# EAGLE design buzzer (EAGLE 5.11)
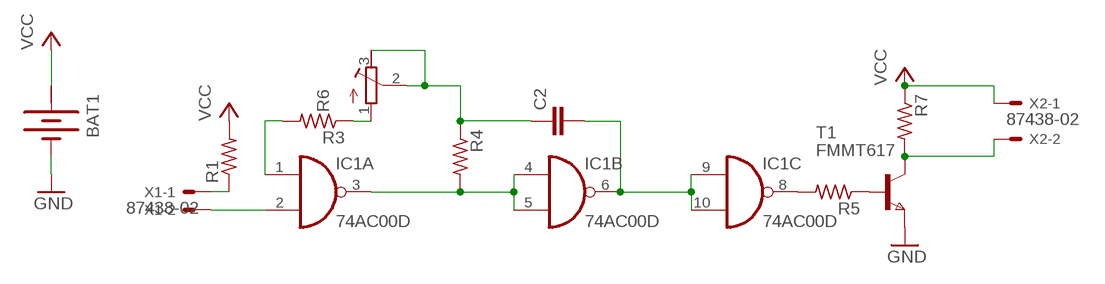
[diagram p0: schematic, sheet 1]

## Parts
BAT1  BATTERY  [BATTERY]
C2  C-EUC3225  [C3225]
IC1  74AC00D  [SO14]
R1  R-US_M0805  [M0805]
R3  R-US_M0805  [M0805]
R4  R-US_M0805  [M0805]
R5  R-US_M0805  [M0805]
R6  R-TRIMMTSM53YJ  [RTRIMTSM53YJ]
R7  R-US_M0805  [M0805]
T1  FMMT617  [SOT-23]
X1  87438-02  [87438-02]
X2  87438-02  [87438-02]

## Nets
GND: BAT1.- T1.2(E)
N$1: R5.1 T1.3(B)
N$2: IC1.1(A:I0) R3.2
N$3: IC1.3(A:O) IC1.4(B:I0) IC1.5(B:I1) R4.2
N$4: R3.1 R6.1(E)
N$5: C2.2 IC1.6(B:O) IC1.9(C:I0) IC1.10(C:I1)
N$6: R7.2 T1.1(C) X2.2
N$7: R1.1 X1.1
N$8: C2.1 R4.1 R6.2(S) R6.3(A)
N$9: IC1.2(A:I1) X1.2
N$10: IC1.8(C:O) R5.2
VCC: BAT1.+ R1.2 R7.1 X2.1
Unconnected: IC1.11(D:O) IC1.12(D:I0) IC1.13(D:I1)

## Power pins joined to a net without a drawn wire
+: BAT1.+@1(+)
GND: IC1.7(P:GND)
VCC: IC1.14(P:VCC)

## Library data of the parts
BAT1 = special:BATTERY: BATTERY
C2 = rcl:C-EU: CAPACITOR, European symbol
IC1 = 74xx-eu:74*00: Quad 2-input NAND gate
R1 R3-R5 R7 = resistor:R-US_: RESISTOR, American symbol
R6 = rcl:R-TRIMM: Trimm resistor
T1 = zetex:FMMT6*: NPN SILICON POWER (SWITCHING) TRANSISTORS SuperSOT Source: http://www.zetex.com/3.0/pdf/FMMT617.pdf; MPN: FMMT617; OC_FARNELL: 9526420; OC_NEWARK: 96K9966
X1 X2 = con-molex:87438-02: Wire-to-Board 1.50mm (.059") Pitch Header - Right Angle, SMT, Shrouded Source: http://www.molex.com/product/micro/87438.html; OC_FARNELL: 1711327; OC_NEWARK: unknown

## Board
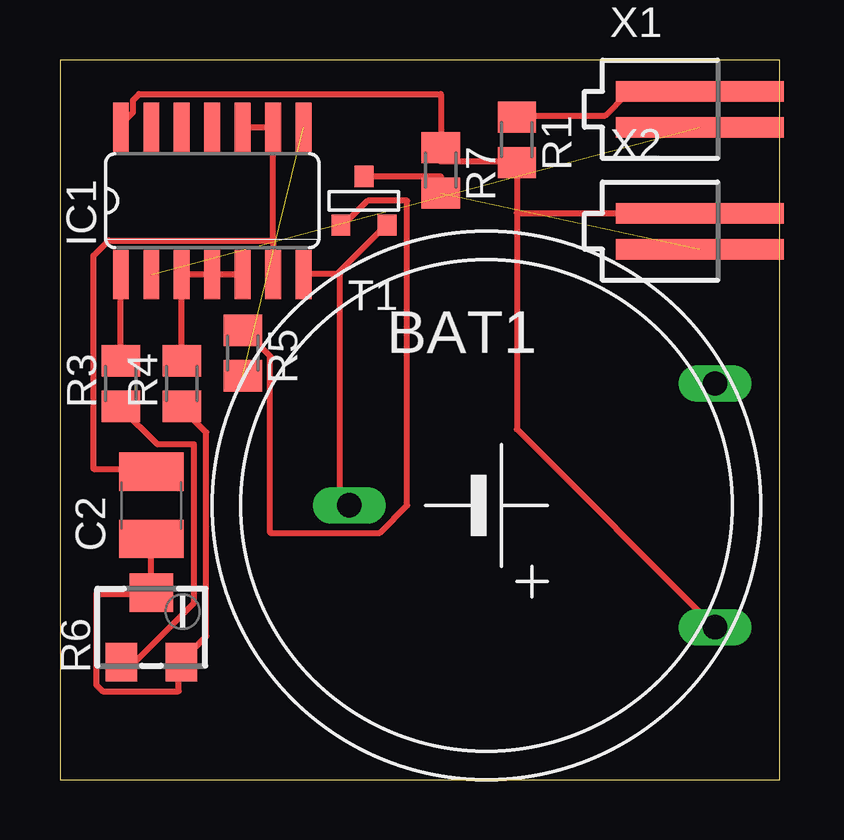
[diagram p1: board, top side]

Size 30 x 30 mm. Coordinates in mm from the lower left corner, seen from the top.
Outline: 0,0 30,0 30,30 0,30 0,0
Copper layers (1*16): Top 0.035mm / dielectric 1.5mm / Bottom 0.035mm
Design rules "default": minimum track width 10mil, minimum drill 24mil, track to track 8mil, track to pad 8mil, pad to pad 8mil, via to via 8mil, smd to smd 8mil, copper to edge 40mil, drill to drill 8mil, minimum pad ring 10mil, minimum via ring 8mil, stop-mask expansion 4mil, vias tented up to drill 0mil, thermal gap 10mil

### Footprints (pad centres in the part's own frame; a part is rotated, then mirrored left to right if it is on the bottom)
BATTERY = drill 1.016 long: + 9.525,-5.08; +@1 9.525,5.08; - -5.715,0
C3225 = smd 1.6 x 2.7: 1 -1.4,0; 2 1.4,0
SO14 = smd 0.66 x 2.032: 1 -3.81,-3.073; 2 -2.54,-3.073; 3 -1.27,-3.073; 4 0,-3.073; 5 1.27,-3.073; 6 2.54,-3.073; 7 3.81,-3.073; 8 3.81,3.073; 9 2.54,3.073; 10 1.27,3.073; 11 0,3.073; 12 -1.27,3.073; 13 -2.54,3.073; 14 -3.81,3.073
M0805 = smd 1.3 x 1.6: 1 -0.95,0; 2 0.95,0
RTRIMTSM53YJ = smd 1.3 x 1.6: 1 -1.25,-1.45; 3 1.25,-1.45 | smd 1.8 x 1.6: 2 0,1.45
SOT-23 = smd 0.787 x 0.889: 1 0.025,-1.016; 2 -0.94,1.016; 3 0.991,1.016
87438-02 = smd 7 x 0.85: 1 0,0.75; 2 0,-0.75

### Placement (x,y rotation side)
BAT1  17.78,11.43 0 top
C2  3.81,11.43 90 top
IC1  6.35,24.13 0 top
R1  19.05,26.67 270 top
R3  2.54,16.51 90 top
R4  5.08,16.51 90 top
R5  7.62,17.78 270 top
R6  3.81,6.35 0 top
R7  15.88,25.4 270 top
T1  12.7,24.13 180 top
X1  26.67,27.94 0 top
X2  26.67,22.86 0 top

### Tracks (layer width: path | path; a pad name or v marks a point on that pad's centre or on a via)
GND
  Top 0.254: 11.62,21.14 11.56,21.08 10.16,21.08 IC1.7 | 11.62,21.14 13.59,23.11 T1.2 | BAT1.- 11.68,11.81 11.68,21.08 11.62,21.14
N$1
  Top 0.254: T1.3 11.81,23.11 12.83,24.13 14.48,24.13 14.48,11.43 13.34,10.29 8.76,10.29 8.76,17.65 7.62,18.8 R5.1
N$2
  Top 0.254: R3.2 IC1.1
N$3
  Top 0.254: R4.2 IC1.3 5.08,21.08 6.35,21.08 | 6.35,21.08 7.62,21.08 IC1.5 | 6.35,21.08 IC1.4
N$4
  Top 0.254: R3.1 2.54,15.49 4.06,13.97 5.59,13.97 5.59,7.37 3.17,4.95 2.67,4.95 R6.1
N$5
  Top 0.254: 8.89,22.48 8.89,27.18 | 8.89,22.48 IC1.6 | 8.89,27.18 7.62,27.18 IC1.10 | 8.89,27.18 IC1.9 | 8.89,22.48 2.03,22.48 1.4,21.84 1.4,12.95 3.81,12.95 C2.2
N$6  (1 unrouted)
  Top 0.254: T1.1 15.88,25.15 R7.2
N$7
  Top 0.254: R1.1 19.05,27.69 22.73,27.69 23.62,28.57 26.67,28.57 X1.1
N$8
  Top 0.254: C2.1 R6.2 3.81,7.75 1.52,7.75 1.52,3.94 1.78,3.68 4.95,3.68 4.95,4.83 R6.3 5.08,4.95 6.1,5.97 6.1,14.48 5.08,15.49 R4.1
N$9  (1 unrouted)
N$10  (1 unrouted)
VCC
  Top 0.254: IC1.14 2.54,27.3 3.05,27.81 3.05,28.32 3.3,28.57 15.88,28.57 R7.1 15.88,25.78 19.05,25.78 R1.2 19.05,23.62 | BAT1.+ 19.05,14.61 19.05,23.62 | 19.05,23.62 26.67,23.62 X2.1